# Altium schematic sheet Server DDR3L.schdoc
size 529 x 350 mm
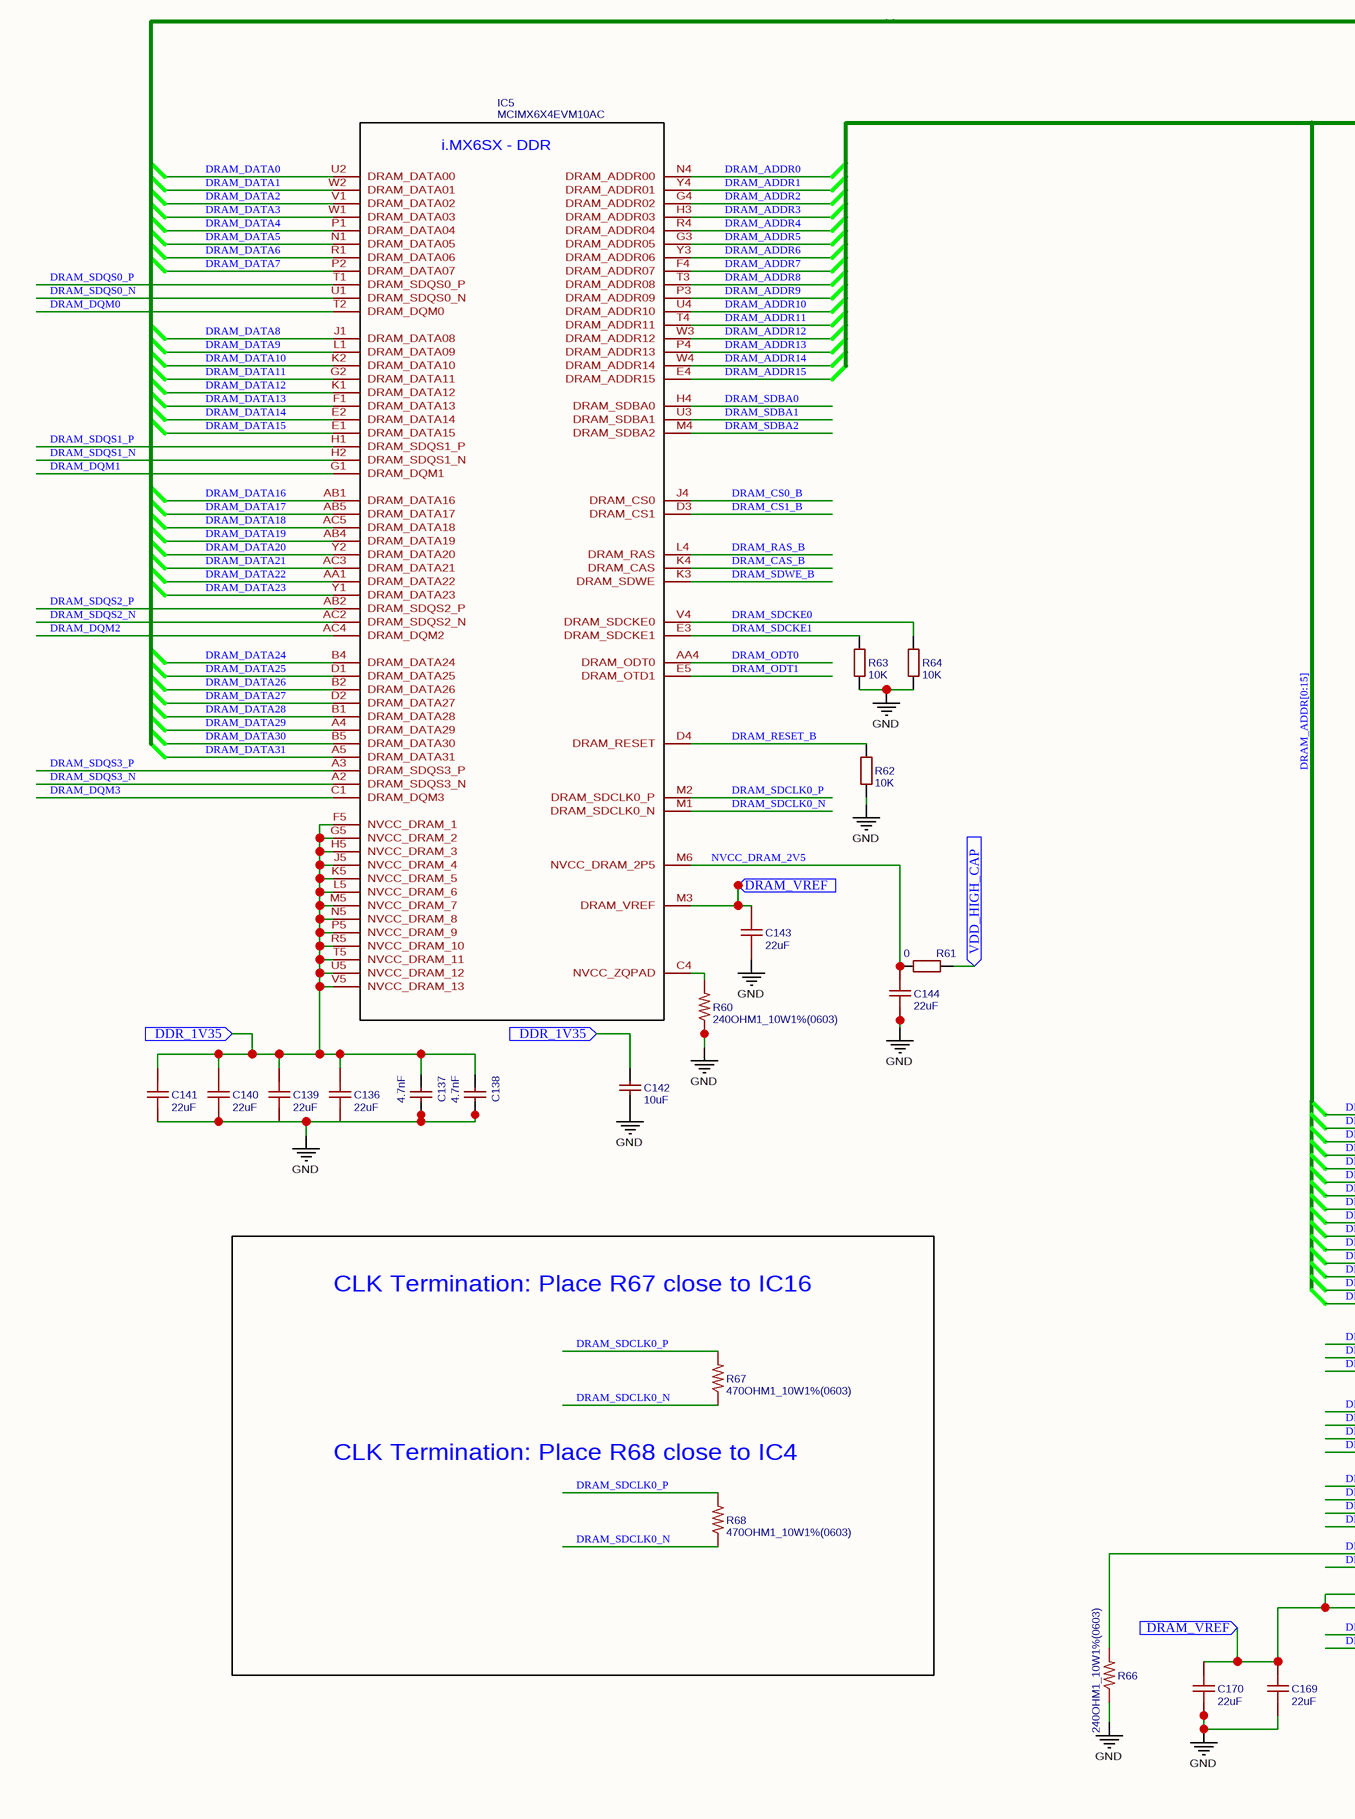
[diagram p0: Server DDR3L.schdoc, left]
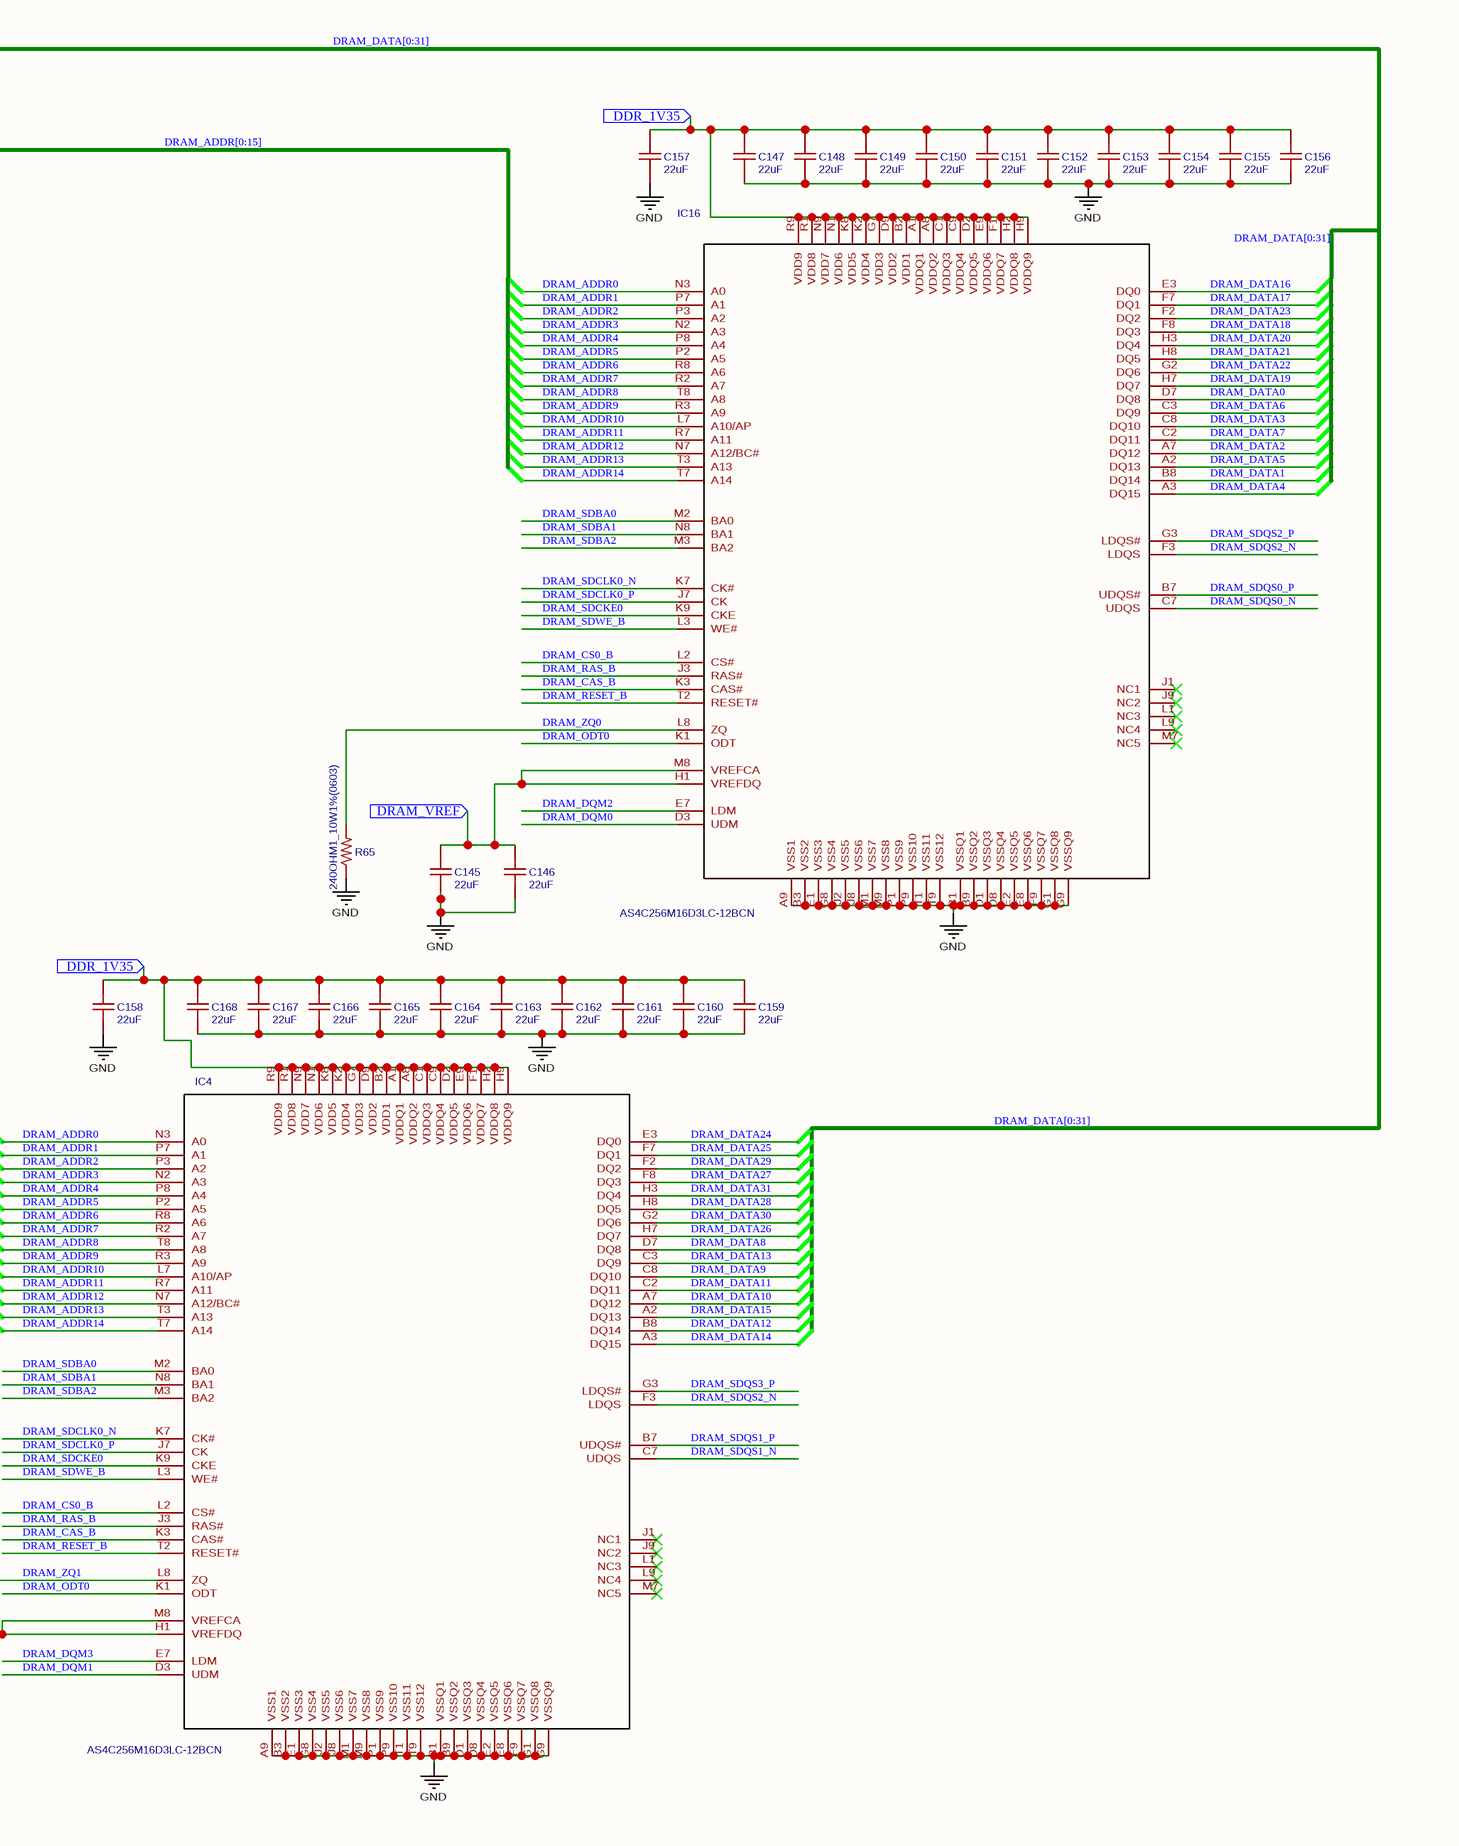
[diagram p1: Server DDR3L.schdoc, right]

## Parts
C136  22uF  [C0603]
C137  4.7nF  [C0805]
C138  4.7nF  [C0805]
C139  22uF  [C0603]
C140  22uF  [C0603]
C141  22uF  [C0603]
C142  10uF  [C0402]
C143  22uF  [C0603]
C144  22uF  [C0603]
C145  22uF  [C0603]
C146  22uF  [C0603]
C147  22uF  [C0603]
C148  22uF  [C0603]
C149  22uF  [C0603]
C150  22uF  [C0603]
C151  22uF  [C0603]
C152  22uF  [C0603]
C153  22uF  [C0603]
C154  22uF  [C0603]
C155  22uF  [C0603]
C156  22uF  [C0603]
C157  22uF  [C0603]
C158  22uF  [C0603]
C159  22uF  [C0603]
C160  22uF  [C0603]
C161  22uF  [C0603]
C162  22uF  [C0603]
C163  22uF  [C0603]
C164  22uF  [C0603]
C165  22uF  [C0603]
C166  22uF  [C0603]
C167  22uF  [C0603]
C168  22uF  [C0603]
C169  22uF  [C0603]
C170  22uF  [C0603]
IC4  AS4C256M16D3LC-12BCN  [BGA96C80P9X16_750X1350X120]
IC5  MCIMX6X4EVM10AC  [BGA529C80P23X23_1900X1900X152]
IC16  AS4C256M16D3LC-12BCN  [BGA96C80P9X16_750X1350X120]
R60  240OHM1_10W1%(0603)  [0603-RES]
R61  0  [R0402]
R62  10K  [R0805]
R63  10K  [R0805]
R64  10K  [R0805]
R65  240OHM1_10W1%(0603)  [0603-RES]
R66  240OHM1_10W1%(0603)  [0603-RES]
R67  470OHM1_10W1%(0603)  [0603-RES]
R68  470OHM1_10W1%(0603)  [0603-RES]

## Ports
DDR_1V35 (in), DRAM_VREF (in), VDD_HIGH_CAP (in)

## Nets
GND: C136.1 C137.1 C138.1 C139.1 C140.1 C141.1 C142.1 C143.1 C144.1 C145.1 C146.1 C147.1 C148.1 C149.1 C150.1 C151.1 C152.1 C153.1 C154.1 C155.1 C156.1 C157.1 C158.1 C159.1 C160.1 C161.1 C162.1 C163.1 C164.1 C165.1 C166.1 C167.1 C168.1 C169.1 C170.1 IC4.A9(VSS1) IC4.B1(VSSQ1) IC4.B3(VSS2) IC4.B9(VSSQ2) IC4.D1(VSSQ3) IC4.D8(VSSQ4) IC4.E1(VSS3) IC4.E2(VSSQ5) IC4.E8(VSSQ6) IC4.F9(VSSQ7) IC4.G1(VSSQ8) IC4.G8(VSS4) IC4.G9(VSSQ9) IC4.J2(VSS5) IC4.J8(VSS6) IC4.M1(VSS7) IC4.M9(VSS8) IC4.P1(VSS9) IC4.P9(VSS10) IC4.T1(VSS11) IC4.T9(VSS12) IC16.A9(VSS1) IC16.B1(VSSQ1) IC16.B3(VSS2) IC16.B9(VSSQ2) IC16.D1(VSSQ3) IC16.D8(VSSQ4) IC16.E1(VSS3) IC16.E2(VSSQ5) IC16.E8(VSSQ6) IC16.F9(VSSQ7) IC16.G1(VSSQ8) IC16.G8(VSS4) IC16.G9(VSSQ9) IC16.J2(VSS5) IC16.J8(VSS6) IC16.M1(VSS7) IC16.M9(VSS8) IC16.P1(VSS9) IC16.P9(VSS10) IC16.T1(VSS11) IC16.T9(VSS12) R60.1 R62.2 R63.2 R64.2 R65.1 R66.1
DDR_1V35: C136.2 C137.2 C138.2 C139.2 C140.2 C141.2 C142.2 C147.2 C148.2 C149.2 C150.2 C151.2 C152.2 C153.2 C154.2 C155.2 C156.2 C157.2 C158.2 C159.2 C160.2 C161.2 C162.2 C163.2 C164.2 C165.2 C166.2 C167.2 C168.2 IC4.A1(VDDQ1) IC4.A8(VDDQ2) IC4.B2(VDD1) IC4.C1(VDDQ3) IC4.C9(VDDQ4) IC4.D2(VDDQ5) IC4.D9(VDD2) IC4.E9(VDDQ6) IC4.F1(VDDQ7) IC4.G7(VDD3) IC4.H2(VDDQ8) IC4.H9(VDDQ9) IC4.K2(VDD4) IC4.K8(VDD5) IC4.N1(VDD6) IC4.N9(VDD7) IC4.R1(VDD8) IC4.R9(VDD9) IC5.F5(NVCC_DRAM_1) IC5.G5(NVCC_DRAM_2) IC5.H5(NVCC_DRAM_3) IC5.J5(NVCC_DRAM_4) IC5.K5(NVCC_DRAM_5) IC5.L5(NVCC_DRAM_6) IC5.M5(NVCC_DRAM_7) IC5.N5(NVCC_DRAM_8) IC5.P5(NVCC_DRAM_9) IC5.R5(NVCC_DRAM_10) IC5.T5(NVCC_DRAM_11) IC5.U5(NVCC_DRAM_12) IC5.V5(NVCC_DRAM_13) IC16.A1(VDDQ1) IC16.A8(VDDQ2) IC16.B2(VDD1) IC16.C1(VDDQ3) IC16.C9(VDDQ4) IC16.D2(VDDQ5) IC16.D9(VDD2) IC16.E9(VDDQ6) IC16.F1(VDDQ7) IC16.G7(VDD3) IC16.H2(VDDQ8) IC16.H9(VDDQ9) IC16.K2(VDD4) IC16.K8(VDD5) IC16.N1(VDD6) IC16.N9(VDD7) IC16.R1(VDD8) IC16.R9(VDD9) ; port DDR_1V35
DRAM_ADDR0: IC4.N3(A0) IC5.N4(DRAM_ADDR00) IC16.N3(A0)
DRAM_ADDR1: IC4.P7(A1) IC5.Y4(DRAM_ADDR01) IC16.P7(A1)
DRAM_ADDR2: IC4.P3(A2) IC5.G4(DRAM_ADDR02) IC16.P3(A2)
DRAM_ADDR3: IC4.N2(A3) IC5.H3(DRAM_ADDR03) IC16.N2(A3)
DRAM_ADDR4: IC4.P8(A4) IC5.R4(DRAM_ADDR04) IC16.P8(A4)
DRAM_ADDR5: IC4.P2(A5) IC5.G3(DRAM_ADDR05) IC16.P2(A5)
DRAM_ADDR6: IC4.R8(A6) IC5.Y3(DRAM_ADDR06) IC16.R8(A6)
DRAM_ADDR7: IC4.R2(A7) IC5.F4(DRAM_ADDR07) IC16.R2(A7)
DRAM_ADDR8: IC4.T8(A8) IC5.T3(DRAM_ADDR08) IC16.T8(A8)
DRAM_ADDR9: IC4.R3(A9) IC5.P3(DRAM_ADDR09) IC16.R3(A9)
DRAM_ADDR10: IC4.L7(A10/AP) IC5.U4(DRAM_ADDR10) IC16.L7(A10/AP)
DRAM_ADDR11: IC4.R7(A11) IC5.T4(DRAM_ADDR11) IC16.R7(A11)
DRAM_ADDR12: IC4.N7(A12/BC#) IC5.W3(DRAM_ADDR12) IC16.N7(A12/BC#)
DRAM_ADDR13: IC4.T3(A13) IC5.P4(DRAM_ADDR13) IC16.T3(A13)
DRAM_ADDR14: IC4.T7(A14) IC5.W4(DRAM_ADDR14) IC16.T7(A14)
DRAM_ADDR15: IC5.E4(DRAM_ADDR15)
DRAM_CAS_B: IC4.K3(CAS#) IC5.K4(DRAM_CAS) IC16.K3(CAS#)
DRAM_CS0_B: IC4.L2(CS#) IC5.J4(DRAM_CS0) IC16.L2(CS#)
DRAM_CS1_B: IC5.D3(DRAM_CS1)
DRAM_DATA0: IC5.U2(DRAM_DATA00) IC16.D7(DQ8)
DRAM_DATA1: IC5.W2(DRAM_DATA01) IC16.B8(DQ14)
DRAM_DATA2: IC5.V1(DRAM_DATA02) IC16.A7(DQ12)
DRAM_DATA3: IC5.W1(DRAM_DATA03) IC16.C8(DQ10)
DRAM_DATA4: IC5.P1(DRAM_DATA04) IC16.A3(DQ15)
DRAM_DATA5: IC5.N1(DRAM_DATA05) IC16.A2(DQ13)
DRAM_DATA6: IC5.R1(DRAM_DATA06) IC16.C3(DQ9)
DRAM_DATA7: IC5.P2(DRAM_DATA07) IC16.C2(DQ11)
DRAM_DATA8: IC4.D7(DQ8) IC5.J1(DRAM_DATA08)
DRAM_DATA9: IC4.C8(DQ10) IC5.L1(DRAM_DATA09)
DRAM_DATA10: IC4.A7(DQ12) IC5.K2(DRAM_DATA10)
DRAM_DATA11: IC4.C2(DQ11) IC5.G2(DRAM_DATA11)
DRAM_DATA12: IC4.B8(DQ14) IC5.K1(DRAM_DATA12)
DRAM_DATA13: IC4.C3(DQ9) IC5.F1(DRAM_DATA13)
DRAM_DATA14: IC4.A3(DQ15) IC5.E2(DRAM_DATA14)
DRAM_DATA15: IC4.A2(DQ13) IC5.E1(DRAM_DATA15)
DRAM_DATA16: IC5.AB1(DRAM_DATA16) IC16.E3(DQ0)
DRAM_DATA17: IC5.AB5(DRAM_DATA17) IC16.F7(DQ1)
DRAM_DATA18: IC5.AC5(DRAM_DATA18) IC16.F8(DQ3)
DRAM_DATA19: IC5.AB4(DRAM_DATA19) IC16.H7(DQ7)
DRAM_DATA20: IC5.Y2(DRAM_DATA20) IC16.H3(DQ4)
DRAM_DATA21: IC5.AC3(DRAM_DATA21) IC16.H8(DQ5)
DRAM_DATA22: IC5.AA1(DRAM_DATA22) IC16.G2(DQ6)
DRAM_DATA23: IC5.Y1(DRAM_DATA23) IC16.F2(DQ2)
DRAM_DATA24: IC4.E3(DQ0) IC5.B4(DRAM_DATA24)
DRAM_DATA25: IC4.F7(DQ1) IC5.D1(DRAM_DATA25)
DRAM_DATA26: IC4.H7(DQ7) IC5.B2(DRAM_DATA26)
DRAM_DATA27: IC4.F8(DQ3) IC5.D2(DRAM_DATA27)
DRAM_DATA28: IC4.H8(DQ5) IC5.B1(DRAM_DATA28)
DRAM_DATA29: IC4.F2(DQ2) IC5.A4(DRAM_DATA29)
DRAM_DATA30: IC4.G2(DQ6) IC5.B5(DRAM_DATA30)
DRAM_DATA31: IC4.H3(DQ4) IC5.A5(DRAM_DATA31)
DRAM_DQM0: IC5.T2(DRAM_DQM0) IC16.D3(UDM)
DRAM_DQM1: IC4.D3(UDM) IC5.G1(DRAM_DQM1)
DRAM_DQM2: IC5.AC4(DRAM_DQM2) IC16.E7(LDM)
DRAM_DQM3: IC4.E7(LDM) IC5.C1(DRAM_DQM3)
DRAM_ODT0: IC4.K1(ODT) IC5.AA4(DRAM_ODT0) IC16.K1(ODT)
DRAM_ODT1: IC5.E5(DRAM_OTD1)
DRAM_RAS_B: IC4.J3(RAS#) IC5.L4(DRAM_RAS) IC16.J3(RAS#)
DRAM_RESET_B: IC4.T2(RESET#) IC5.D4(DRAM_RESET) IC16.T2(RESET#) R62.1
DRAM_SDBA0: IC4.M2(BA0) IC5.H4(DRAM_SDBA0) IC16.M2(BA0)
DRAM_SDBA1: IC4.N8(BA1) IC5.U3(DRAM_SDBA1) IC16.N8(BA1)
DRAM_SDBA2: IC4.M3(BA2) IC5.M4(DRAM_SDBA2) IC16.M3(BA2)
DRAM_SDCKE0: IC4.K9(CKE) IC5.V4(DRAM_SDCKE0) IC16.K9(CKE) R64.1
DRAM_SDCKE1: IC5.E3(DRAM_SDCKE1) R63.1
DRAM_SDCLK0_N: IC4.K7(CK#) IC5.M1(DRAM_SDCLK0_N) IC16.K7(CK#) R67.1 R68.1
DRAM_SDCLK0_P: IC4.J7(CK) IC5.M2(DRAM_SDCLK0_P) IC16.J7(CK) R67.2 R68.2
DRAM_SDQS0_N: IC5.U1(DRAM_SDQS0_N) IC16.C7(UDQS)
DRAM_SDQS0_P: IC5.T1(DRAM_SDQS0_P) IC16.B7(UDQS#)
DRAM_SDQS1_N: IC4.C7(UDQS) IC5.H2(DRAM_SDQS1_N)
DRAM_SDQS1_P: IC4.B7(UDQS#) IC5.H1(DRAM_SDQS1_P)
DRAM_SDQS2_N: IC4.F3(LDQS) IC5.AC2(DRAM_SDQS2_N) IC16.F3(LDQS)
DRAM_SDQS2_P: IC5.AB2(DRAM_SDQS2_P) IC16.G3(LDQS#)
DRAM_SDQS3_N: IC5.A2(DRAM_SDQS3_N)
DRAM_SDQS3_P: IC4.G3(LDQS#) IC5.A3(DRAM_SDQS3_P)
DRAM_SDWE_B: IC4.L3(WE#) IC5.K3(DRAM_SDWE) IC16.L3(WE#)
DRAM_VREF: C143.2 C145.2 C146.2 C169.2 C170.2 IC4.H1(VREFDQ) IC4.M8(VREFCA) IC5.M3(DRAM_VREF) IC16.H1(VREFDQ) IC16.M8(VREFCA) ; port DRAM_VREF
DRAM_ZQ0: IC16.L8(ZQ) R65.2
DRAM_ZQ1: IC4.L8(ZQ) R66.2
NVCC_DRAM_2V5: C144.2 IC5.M6(NVCC_DRAM_2P5) R61.1
VDD_HIGH_CAP: R61.2 ; port VDD_HIGH_CAP
NetIC5_C4: IC5.C4(NVCC_ZQPAD) R60.2

Not connected (* = marked no-connect by the designer): IC4 J1(NC1)* J9(NC2)* L1(NC3)* L9(NC4)* M7(NC5)*; IC16 J1(NC1)* J9(NC2)* L1(NC3)* L9(NC4)* M7(NC5)*

## Buses and harness runs
bus DRAM_ADDR[0:15]
bus DRAM_DATA[0:31]

## Notes on the sheet
- CLK Termination: Place R67 close to IC16
- CLK Termination: Place R68 close to IC4
- (in symbol MCIMX6X4EVM10AC) i.MX6SX - DDR

## Library data of the parts
C136 C139-C141 C143-C170 = 22uF: BOM_Manufacturer: SAMSUNG; BOM_Manufacturer Part: CL10A226MP8NUNE; nameAlias: Capacitance; SMT Type: Extend; BOM_Supplier: LCSC; BOM_Supplier Part: C86295; BOM_LCSC Assembly: Yes; spicePre: C; spiceSymbolName: CL10A226MP8NUNE
C137 C138 = 4.7nF: BOM_Manufacturer: FH; BOM_Manufacturer Part: 0805B472K500NT; nameAlias: Capacitance; SMT Type: Basic; BOM_Supplier: LCSC; BOM_LCSC Assembly: Yes; BOM_Supplier Part: C1744; spicePre: C; spiceSymbolName: 0805B472K500NT
C142 = 10uF: BOM_Manufacturer Part: CL05A106MQ5NUNC; BOM_Manufacturer: SAMSUNG; nameAlias: Capacitance; SMT Type: Basic; BOM_Supplier: LCSC; BOM_LCSC Assembly: Yes; BOM_Supplier Part: C15525; spicePre: C; spiceSymbolName: CL05A106MQ5NUNC
IC4 IC16 = AS4C256M16D3LC-12BCN: Contributor: Ke'Ondrae_Mell; spicePre: I; spiceSymbolName: AS4C256M16D3LC-12BCN
IC5 = MCIMX6X4EVM10AC: subpart_no: 1; Contributor: Ke'Ondrae_Mell; spicePre: I; spiceSymbolName: MCIMX6X4EVM10AC
R60 R65 R66 = 240OHM1_10W1%(0603): description: RES-07849; Contributor: SparkFun; spicePre: R; spiceSymbolName: 240OHM1_10W1%(0603)
R61 = 0: BOM_Manufacturer: KOA; BOM_Manufacturer Part: RK73Z1ETTP; nameAlias: Resistance (Ohms); BOM_Supplier: LCSC; BOM_Supplier Part: C131359; spicePre: R; spiceSymbolName: RK73Z1ETTP
R62-R64 = 10K: BOM_Manufacturer: UniOhm; BOM_Manufacturer Part: 0805W8F1002T5E; nameAlias: Resistance (Ohms); SMT Type: Basic; BOM_Supplier: LCSC; BOM_LCSC Assembly: Yes; BOM_Supplier Part: C17414; spicePre: R; spiceSymbolName: 0805W8F1002T5E
R67 R68 = 470OHM1_10W1%(0603): description: RES-07869; Contributor: SparkFun; spicePre: R; spiceSymbolName: 470OHM1_10W1%(0603)